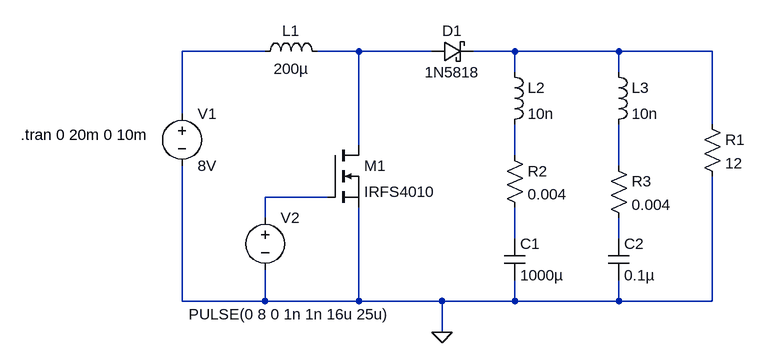
[diagram p0: schematic grad_project_1_esr_esl.asc]
grad_project_1_esr_esl.asc, the LTspice schematic file:
Version 4
SHEET 1 936 680
WIRE 192 32 64 32
WIRE 336 32 272 32
WIRE 448 32 336 32
WIRE 576 32 512 32
WIRE 736 32 576 32
WIRE 880 32 736 32
WIRE 576 64 576 32
WIRE 736 64 736 32
WIRE 64 128 64 32
WIRE 880 144 880 32
WIRE 336 176 336 32
WIRE 576 192 576 144
WIRE 736 208 736 144
WIRE 288 256 192 256
WIRE 192 288 192 256
WIRE 576 320 576 272
WIRE 736 320 736 288
WIRE 64 416 64 208
WIRE 192 416 192 368
WIRE 192 416 64 416
WIRE 336 416 336 272
WIRE 336 416 192 416
WIRE 464 416 336 416
WIRE 576 416 576 384
WIRE 576 416 464 416
WIRE 736 416 736 384
WIRE 736 416 576 416
WIRE 880 416 880 224
WIRE 880 416 736 416
WIRE 464 464 464 416
FLAG 464 464 0
SYMBOL voltage 64 112 R0
WINDOW 123 0 0 Left 0
WINDOW 39 0 0 Left 0
SYMATTR InstName V1
SYMATTR Value 8V
SYMBOL ind 176 48 R270
WINDOW 0 32 56 VTop 2
WINDOW 3 5 56 VBottom 2
SYMATTR InstName L1
SYMATTR Value 200µ
SYMBOL cap 560 320 R0
SYMATTR InstName C1
SYMATTR Value 1000µ
SYMBOL nmos 288 176 R0
SYMATTR InstName M1
SYMATTR Value IRFS4010
SYMBOL res 864 128 R0
SYMATTR InstName R1
SYMATTR Value 12
SYMBOL cap 720 320 R0
SYMATTR InstName C2
SYMATTR Value 0.1µ
SYMBOL schottky 448 48 R270
WINDOW 0 32 32 VTop 2
WINDOW 3 0 32 VBottom 2
SYMATTR InstName D1
SYMATTR Value 1N5818
SYMBOL voltage 192 272 R0
WINDOW 3 -118 164 Left 2
WINDOW 123 0 0 Left 0
WINDOW 39 0 0 Left 0
SYMATTR InstName V2
SYMATTR Value PULSE(0 8 0 1n 1n 16u 25u)
SYMBOL res 560 176 R0
SYMATTR InstName R2
SYMATTR Value 0.004
SYMBOL res 720 192 R0
SYMATTR InstName R3
SYMATTR Value 0.004
SYMBOL ind 560 48 R0
SYMATTR InstName L2
SYMATTR Value 10n
SYMBOL ind 720 48 R0
SYMATTR InstName L3
SYMATTR Value 10n
TEXT -184 160 Left 2 !.tran 0 20m 0 10m

The netlist it stands for:
* grad_project_1_esr_esl.asc
V1 N001 0 8V
L1 N001 N002 200µ
C1 N007 0 1000µ
M1 N002 N006 0 0 IRFS4010
R1 N003 0 12
C2 N008 0 0.1µ
D1 N002 N003 1N5818
V2 N006 0 PULSE(0 8 0 1n 1n 16u 25u)
R2 N004 N007 0.004
R3 N005 N008 0.004
L2 N003 N004 10n
L3 N003 N005 10n
.model D D
.lib standard.dio
.model NMOS NMOS
.model PMOS PMOS
.lib standard.mos
.tran 0 20m 0 10m
.backanno
.end